# Altium schematic sheet Лист 3.SchDoc
size 420 x 297 mm; Scale: 1:1; Обозначение документа: АЛ.001.001 Э3; Номер листа: 3; Общее количество листов: 5; Разраб.: Иванов; Пров.: Петров; Утв.: Сидоров; Масштаб: 1:1; Наименование организации: ОАО "Ваша фирма"; Перв. применение: АБВГ.123456.000; Наименование изделия 3: Схема электрическая принципиальная; Нач. отд.: Нач. отд.; Фамилия нач. отд.: Сидоров
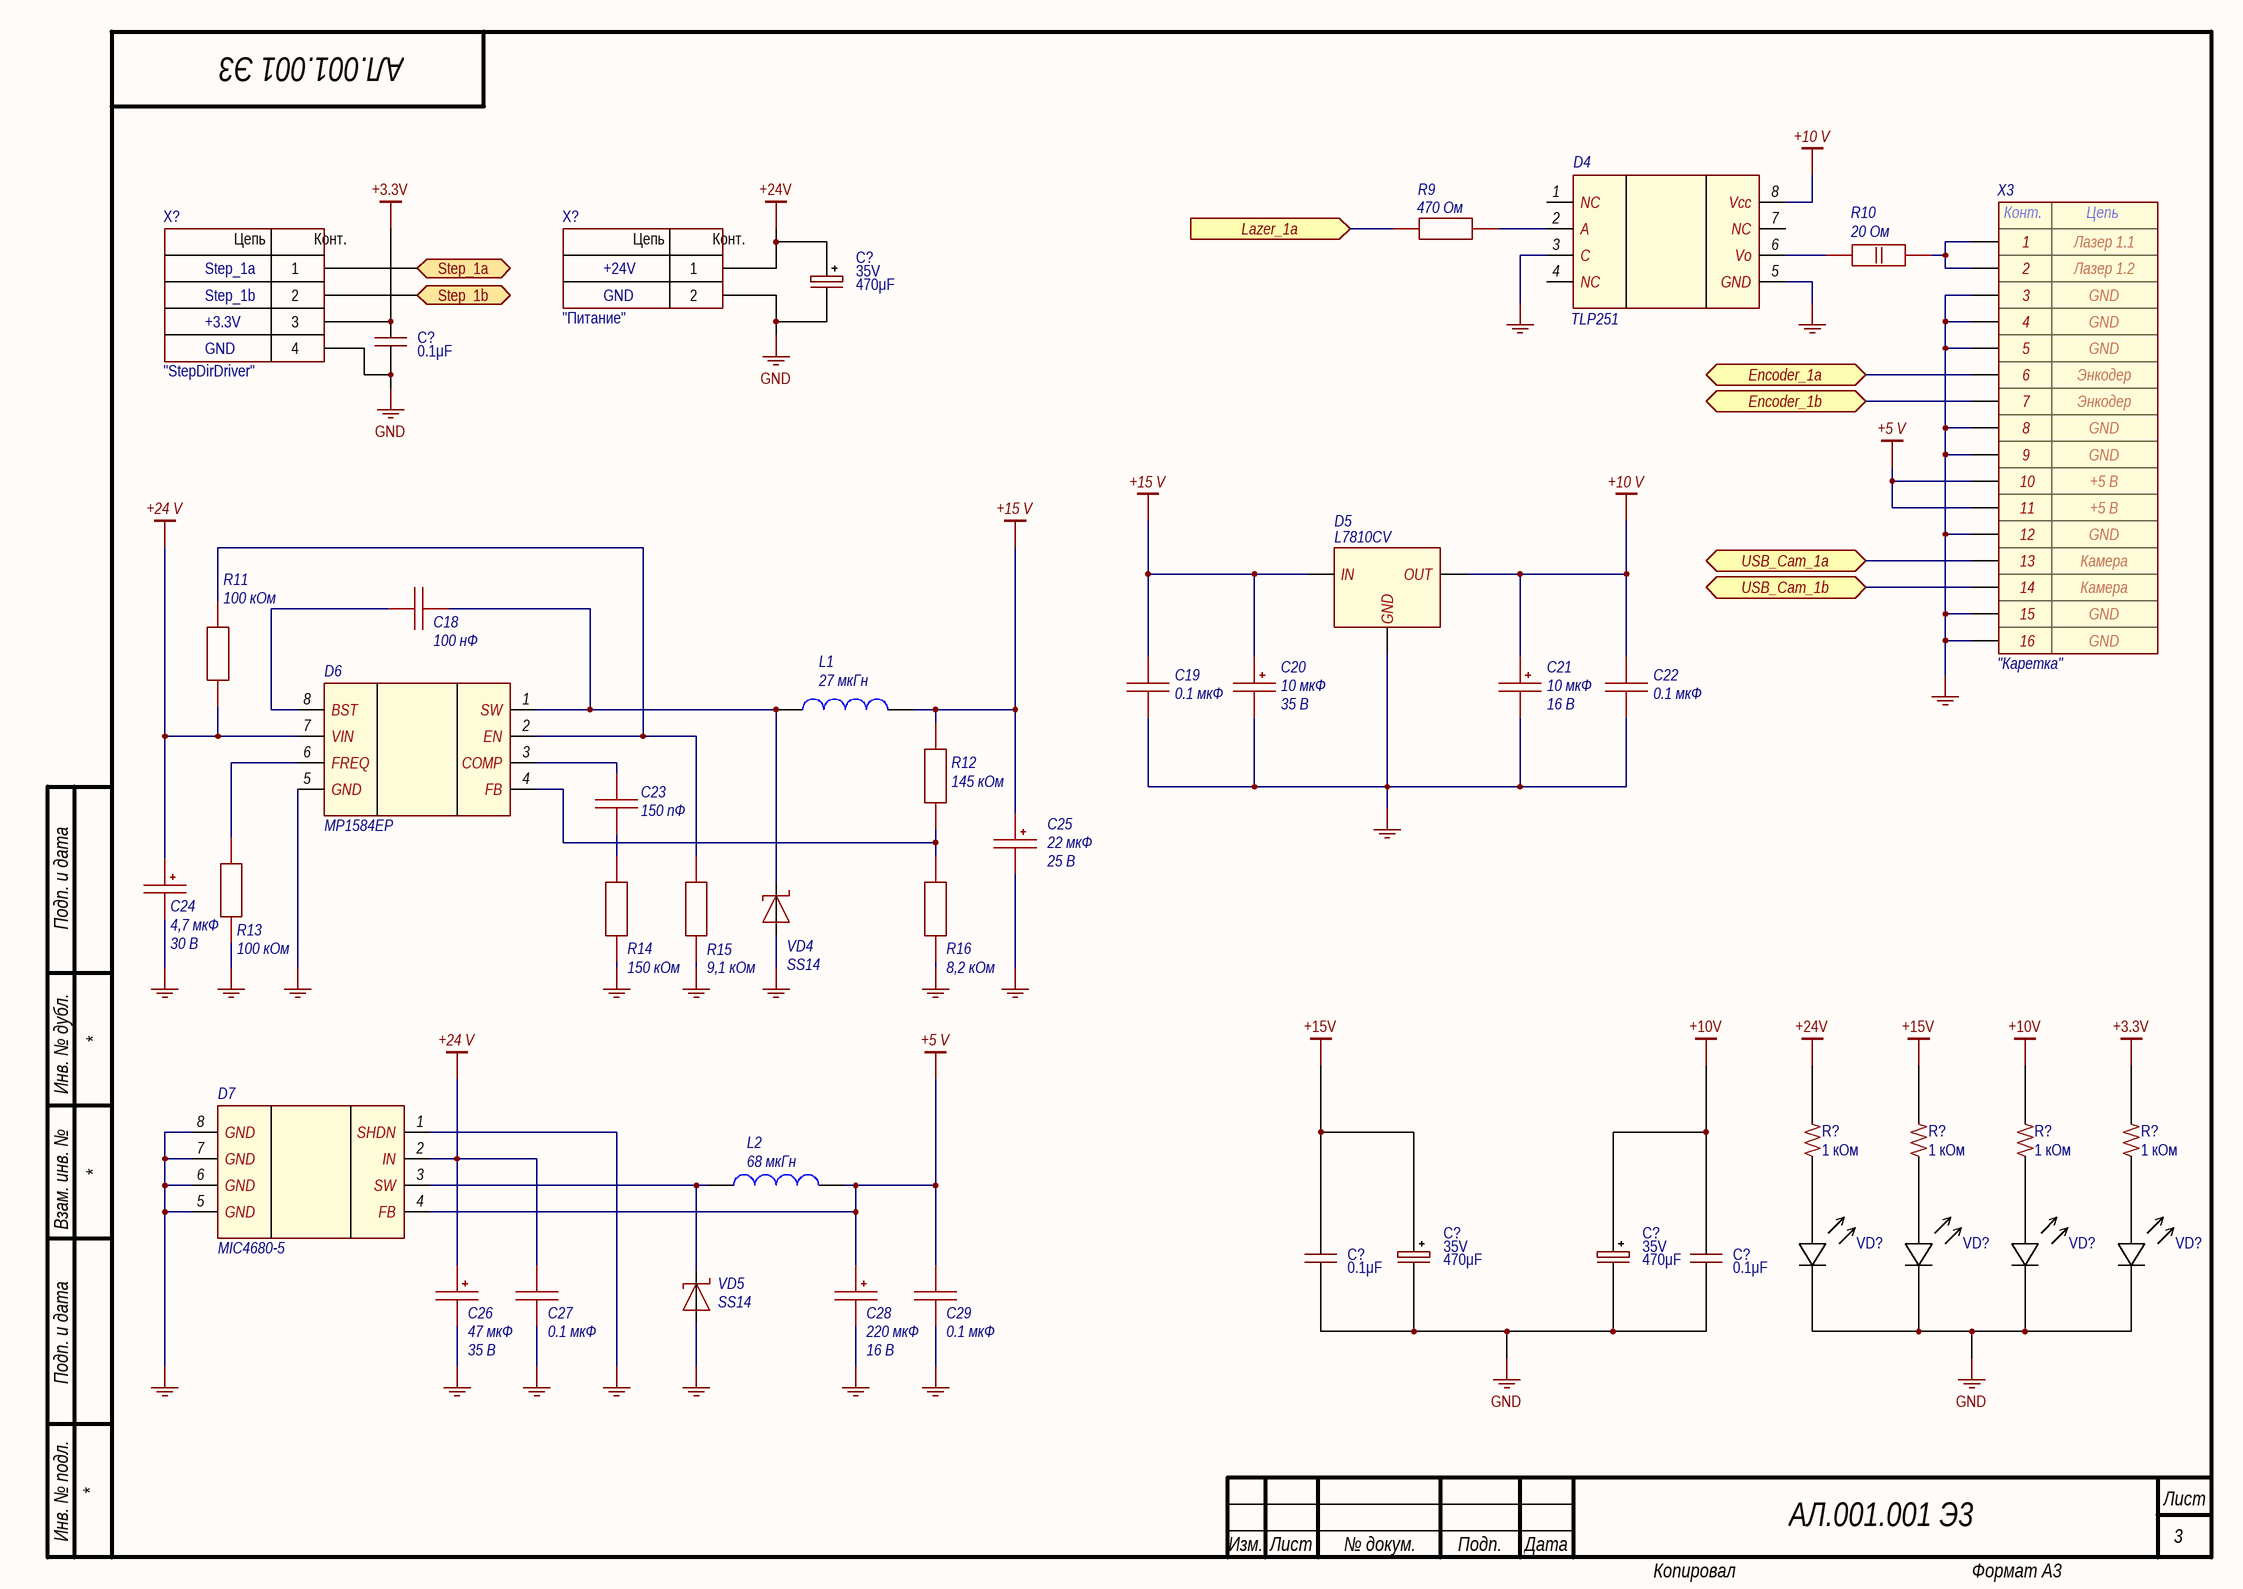
[diagram p0: Лист 3.SchDoc]

## Parts
(Parts that share a designator on the sheet are numbered #1, #2 ... from top to bottom, then left to right.)
C18  value 100 нФ  [CAP: 0805]
C19  value 0.1 мкФ  [CAP: 0805]
C20  value 10 мкФ  Voltage: 35 В  [CAP: D5C2H11]
C21  value 10 мкФ  Voltage: 16 В  [CAP: D5C2H11]
C22  value 0.1 мкФ  [CAP: 0805]
C23  value 150 пФ  [CAP: 0805]
C24  value 4,7 мкФ  Voltage: 30 В  [CAP: TANTAL-C]
C25  value 22 мкФ  Voltage: 25 В  [CAP: TANTAL-C]
C26  value 47 мкФ  Voltage: 35 В  [CAP: D5C2H11]
C27  value 0.1 мкФ  [CAP: 0805]
C28  value 220 мкФ  Voltage: 16 В  [CAP: D6.3C2.5H11]
C29  value 0.1 мкФ  [CAP: 0805]
C?#1  Напряжение: 35V  Значение: 470μF  [CAP: D10C5H12.5]
C?#2  Значение: 0.1μF  [CAP: 0805]  (hidden comment: Ceramic_SMD)
C?#3  Напряжение: 35V  Значение: 470μF  [CAP: D10C5H12.5]
C?#4  Напряжение: 35V  Значение: 470μF  [CAP: D10C5H12.5]
C?#5  Значение: 0.1μF  [CAP: 0805]  (hidden comment: Ceramic_SMD)
C?#6  Значение: 0.1μF  [CAP: 0805]  (hidden comment: Ceramic_SMD)
D4  TLP251  [8-SDIP]
D5  L7810CV  [TO220]
D6  MP1584EP  [8-SOIC]
D7  MIC4680-5  [8-SOIC]
L1  value 27 мкГн  [IND: 7.3x7.3]  (hidden comment: Inductor)
L2  value 68 мкГн  [IND: 7.3x7.3]  (hidden comment: Inductor)
R9  470 Ом  [RES: 0805]
R10  20 Ом  [RES: 2 W]
R11  value 100 кОм  [RES: 0805]  (hidden comment: 470 Ом)
R12  value 145 кОм  [RES: 0805]  (hidden comment: 470 Ом)
R13  value 100 кОм  [RES: 0805]  (hidden comment: 470 Ом)
R14  value 150 кОм  [RES: 0805]  (hidden comment: 470 Ом)
R15  value 9,1 кОм  [RES: 0805]  (hidden comment: 470 Ом)
R16  value 8,2 кОм  [RES: 0805]  (hidden comment: 470 Ом)
R?#1  Значение: 1 кОм  [RES: 0805]  (hidden comment: Resistor_SMD)
R?#2  Значение: 1 кОм  [RES: 0805]  (hidden comment: Resistor_SMD)
R?#3  Значение: 1 кОм  [RES: 0805]  (hidden comment: Resistor_SMD)
R?#4  Значение: 1 кОм  [RES: 0805]  (hidden comment: Resistor_SMD)
VD4  PartNumber: SS14  [DIODE: SMA]
VD5  PartNumber: SS14  [DIODE: SMA]
VD?#1  (no value)  [LED: 0805G]
VD?#2  (no value)  [LED: 0805G]
VD?#3  (no value)  [LED: 0805G]
VD?#4  (no value)  [LED: 0805G]
X3  CommentText: "Каретка"  [CON: IDC-16MS]
X?#1  CommentText: "StepDirDriver"  [CON: 15EDGVC-3.5-04]
X?#2  CommentText: "Питание"  [CON: 15EDGVC-3.5-02 (or 691321100002)]

## Ports
Encoder_1a (bidir), Encoder_1b (bidir), Lazer_1a (in), Step_1a (bidir), Step_1b (bidir), USB_Cam_1a (bidir), USB_Cam_1b (bidir)

## Nets
+3.3V: C?#2.2 R?#4.2 X?#1.3
+5 V: C28.1 C29.2 D7.4(FB) L2.2 X3.10 X3.11
+10 V: C21.1 C22.2 D4.8(Vcc) D5.3(OUT)
+10V: C?#4.1 C?#6.2 R?#3.2
+15 V: C19.2 C20.1 C25.1 D5.1(IN) L1.2 R12.1
+15V: C?#3.1 C?#5.2 R?#2.2
+24 V: C24.1 C26.1 C27.2 D6.7(VIN) D7.2(IN) R11.2
+24V: C?#1.1 R?#1.2 X?#2.1
GND: C19.1 C20.2 C21.2 C22.1 C24.2 C25.2 C26.2 C27.1 C28.2 C29.1 C?#1.2 C?#2.1 C?#3.2 C?#4.2 C?#5.1 C?#6.1 D4.3(C) D4.5(GND) D5.2(GND) D6.5(GND) D7.1(SHDN) D7.5(GND) D7.6(GND) D7.7(GND) D7.8(GND) R13.2 R14.2 R15.2 R16.2 VD4.1 VD5.1 VD?#1.2(C) VD?#2.2(C) VD?#3.2(C) VD?#4.2(C) X3.3 X3.4 X3.5 X3.8 X3.9 X3.12 X3.15 X3.16 X?#1.4 X?#2.2
Encoder_1a: X3.6 ; port Encoder_1a
Encoder_1b: X3.7 ; port Encoder_1b
Lazer_1a: R9.2 ; port Lazer_1a
Step_1a: X?#1.1 ; port Step_1a
Step_1b: X?#1.2 ; port Step_1b
USB_Cam_1a: X3.13 ; port USB_Cam_1a
USB_Cam_1b: X3.14 ; port USB_Cam_1b
NetC18_1: C18.1 D6.8(BST)
NetC18_2: C18.2 D6.1(SW) L1.1 VD4.2
NetC23_1: C23.1 R14.1
NetC23_2: C23.2 D6.3(COMP)
NetD4_2: D4.2(A) R9.1
NetD4_6: D4.6(Vo) R10.1
NetD6_2: D6.2(EN) R11.1 R15.1
NetD6_4: D6.4(FB) R12.2 R16.1
NetD6_6: D6.6(FREQ) R13.1
NetD7_3: D7.3(SW) L2.1 VD5.2
NetR10_2: R10.2 X3.1 X3.2
NetR?#1_1: R?#1.1 VD?#1.1(A)
NetR?#2_1: R?#2.1 VD?#2.1(A)
NetR?#3_1: R?#3.1 VD?#3.1(A)
NetR?#4_1: R?#4.1 VD?#4.1(A)

Not connected (* = marked no-connect by the designer): D4 1(NC) 4(NC) 7(NC)

## Notes on the sheet
- Step_1a
- Step_1b
- +3.3V
- +24V
- GND
- Подп. и дата
- Инв. № дубл.
- Взам. инв. №
- Инв. № подл.
- Изм.
- Лист
- № докум.
- Подп.
- Дата
- Копировал
- Формат А3
- (in symbol Connector_terminal_2pin) Цепь; Конт.
- (in symbol Connector_terminal_4pin) Цепь; Конт.
- (in symbol IDC-16) Конт.; Цепь

## Library data of the parts
C18 = Ceramic_0805: Manufacturer: Yageo; PartNumber: CC0805KRX7R7BB104; ValueManufacturerPartNumber: Ceramic capacitor, 100 нФ, X7R, ±10%, 16V, 0805, -55...+125°C; TypeCapacitor: Ceramic capacitor; Tolerance: ±10%; TypeDielectric: X7R; Voltage: 16V; Package: 0805; HelpURL: https://www.digikey.com/product-detail/en/yageo/CC0805KRX7R7BB104/311-1142-1-ND/303052; Temperature: -55...+125°C
C19 C22 C27 C29 = Ceramic_0805: Manufacturer: Yageo; PartNumber: CC0805KRX7R7BB104; ValueManufacturerPartNumber: Ceramic capacitor, 0.1 мкФ, X7R, ±10%, 16V, 0805, -55...+125°C; TypeCapacitor: Ceramic capacitor; Tolerance: ±10%; TypeDielectric: X7R; Voltage: 16V; Package: 0805; HelpURL: https://www.digikey.com/product-detail/en/yageo/CC0805KRX7R7BB104/311-1142-1-ND/303052; Temperature: -55...+125°C
C20 = Aluminium: Manufacturer: Wurth; PartNumber: 860080475013; ValueManufacturerPartNumber: Aluminium capacitor, 10 мкФ, 35 В, ±20%, 54mOhm, 14x10x5 mm, -55...+105°C; TypeCapacitor: Aluminium capacitor; Tolerance: ±20%; Impedance: 54mOhm; Package: 14x10x5 mm; HelpURL: https://www.digikey.com/product-detail/en/wurth-electronics-inc/860080475013/732-9029-1-ND/5728972; Temperature: -55...+105°C
C21 = Aluminium: Manufacturer: Wurth; PartNumber: 860080475013; ValueManufacturerPartNumber: Aluminium capacitor, 10 мкФ, 16 В, ±20%, 54mOhm, 14x10x5 mm, -55...+105°C; TypeCapacitor: Aluminium capacitor; Tolerance: ±20%; Impedance: 54mOhm; Package: 14x10x5 mm; HelpURL: https://www.digikey.com/product-detail/en/wurth-electronics-inc/860080475013/732-9029-1-ND/5728972; Temperature: -55...+105°C
C23 = Ceramic_0805: Manufacturer: Yageo; PartNumber: CC0805KRX7R7BB104; ValueManufacturerPartNumber: Ceramic capacitor, 150 пФ, X7R, ±10%, 16V, 0805, -55...+125°C; TypeCapacitor: Ceramic capacitor; Tolerance: ±10%; TypeDielectric: X7R; Voltage: 16V; Package: 0805; HelpURL: https://www.digikey.com/product-detail/en/yageo/CC0805KRX7R7BB104/311-1142-1-ND/303052; Temperature: -55...+125°C
C24 = Tantal_C: Manufacturer: AVX; PartNumber: F931E226MCC; ValueManufacturerPartNumber: Tantalum capacitor, 4,7 мкФ, 30 В, ±10%, 1.1Ohm, case C (6032), -55...+125°C; Impedance: 1.1Ohm; Tolerance: ±10%; TypeDielectric: X7R; TypeCapacitor: Tantalum capacitor; Package: case C (6032); HelpURL: https://www.digikey.com/product-detail/en/avx-corporation/F931E226MCC/478-8314-1-ND/4006045; Temperature: -55...+125°C
C25 = Tantal_C: Manufacturer: AVX; PartNumber: F931E226MCC; ValueManufacturerPartNumber: Tantalum capacitor, 22 мкФ, 25 В, ±10%, 1.1Ohm, case C (6032), -55...+125°C; Impedance: 1.1Ohm; Tolerance: ±10%; TypeDielectric: X7R; TypeCapacitor: Tantalum capacitor; Package: case C (6032); HelpURL: https://www.digikey.com/product-detail/en/avx-corporation/F931E226MCC/478-8314-1-ND/4006045; Temperature: -55...+125°C
C26 = Aluminium: Manufacturer: Wurth; PartNumber: 860080475013; ValueManufacturerPartNumber: Aluminium capacitor, 47 мкФ, 35 В, ±20%, 54mOhm, 14x10x5 mm, -55...+105°C; TypeCapacitor: Aluminium capacitor; Tolerance: ±20%; Impedance: 54mOhm; Package: 14x10x5 mm; HelpURL: https://www.digikey.com/product-detail/en/wurth-electronics-inc/860080475013/732-9029-1-ND/5728972; Temperature: -55...+105°C
C28 = Aluminium: Manufacturer: Wurth; PartNumber: 860080475013; ValueManufacturerPartNumber: Aluminium capacitor, 220 мкФ, 16 В, ±20%, 54mOhm, 14x10x5 mm, -55...+105°C; TypeCapacitor: Aluminium capacitor; Tolerance: ±20%; Impedance: 54mOhm; Package: 14x10x5 mm; HelpURL: https://www.digikey.com/product-detail/en/wurth-electronics-inc/860080475013/732-9029-1-ND/5728972; Temperature: -55...+105°C
C?#1 C?#3 C?#4 = Алюминиевые: Производитель: Wurth; УникальныйНомер: 860080475013; Типоразмер: 14x10x5 mm; Ссылка: ***; ТипКомпонента: Aluminium capacitor; Точность: ±20%
C?#2 C?#5 C?#6 = Ceramic_SMD: Производитель: Yageo; УникальныйНомер: CC0201KRX7R7BB103; Типоразмер: 0201; Ссылка: ***; ТипКомпонента: Ceramic capacitor; Точность: ±10%; ТипДиэлектрика: X7R; Напряжение: 16V
D5 = 78XX
D7 = MIC4680
L1 L2 = Inductor: Tolerance: ±10%
R9 = Resistor_0805: Manufacturer: Yageo; PartNumber: RC0805JR-07100RL; ValueManufacturerPartNumber: Resistor film, 470 Ом, ±5%, 0805, 0.125W, -55...+125°C; TypeResistor: Resistor film; Power: 0.125W; Tolerance: ±5%; Package: 0805; HelpURL: https://www.digikey.com/product-detail/en/yageo/RC0805JR-07100RL/311-100ARCT-ND/731185; Temperature: -55...+125°C; Value: 470 Ом
R10 = Резистор 2 Вт TH: Value: 20 Ом
R11 R13 = Resistor_0805: Manufacturer: Yageo; PartNumber: RC0805JR-07100RL; ValueManufacturerPartNumber: Resistor film, 100 кОм, ±5%, 0805, 0.125W, -55...+125°C; TypeResistor: Resistor film; Power: 0.125W; Tolerance: ±5%; Package: 0805; HelpURL: https://www.digikey.com/product-detail/en/yageo/RC0805JR-07100RL/311-100ARCT-ND/731185; Temperature: -55...+125°C
R12 = Resistor_0805: Manufacturer: Yageo; PartNumber: RC0805JR-07100RL; ValueManufacturerPartNumber: Resistor film, 145 кОм, ±5%, 0805, 0.125W, -55...+125°C; TypeResistor: Resistor film; Power: 0.125W; Tolerance: ±5%; Package: 0805; HelpURL: https://www.digikey.com/product-detail/en/yageo/RC0805JR-07100RL/311-100ARCT-ND/731185; Temperature: -55...+125°C
R14 = Resistor_0805: Manufacturer: Yageo; PartNumber: RC0805JR-07100RL; ValueManufacturerPartNumber: Resistor film, 150 кОм, ±5%, 0805, 0.125W, -55...+125°C; TypeResistor: Resistor film; Power: 0.125W; Tolerance: ±5%; Package: 0805; HelpURL: https://www.digikey.com/product-detail/en/yageo/RC0805JR-07100RL/311-100ARCT-ND/731185; Temperature: -55...+125°C
R15 = Resistor_0805: Manufacturer: Yageo; PartNumber: RC0805JR-07100RL; ValueManufacturerPartNumber: Resistor film, 9,1 кОм, ±5%, 0805, 0.125W, -55...+125°C; TypeResistor: Resistor film; Power: 0.125W; Tolerance: ±5%; Package: 0805; HelpURL: https://www.digikey.com/product-detail/en/yageo/RC0805JR-07100RL/311-100ARCT-ND/731185; Temperature: -55...+125°C
R16 = Resistor_0805: Manufacturer: Yageo; PartNumber: RC0805JR-07100RL; ValueManufacturerPartNumber: Resistor film, 8,2 кОм, ±5%, 0805, 0.125W, -55...+125°C; TypeResistor: Resistor film; Power: 0.125W; Tolerance: ±5%; Package: 0805; HelpURL: https://www.digikey.com/product-detail/en/yageo/RC0805JR-07100RL/311-100ARCT-ND/731185; Temperature: -55...+125°C
R?#1-R?#4 = Resistor_SMD: Производитель: YAGEO; УникальныйНомер: RC0201JR-07100RL; Типоразмер: 0201; Ссылка: ***; ТипКомпонента: Резистор SMD; Точность: ±5%
VD4 VD5 = Schottky_single: Manufacturer: Diodes Incorporated; ValueManufacturerPartNumber: Schottky diode, 80V, 500mA, 1V, 15pF, SOD-123, -55...+150°C; TypeDiode: Schottky diode; Voltage: 80V; Current: 500mA; VoltageDrop: 1V; RecoveryTime: 15pF; Package: SOD-123; HelpURL: https://www.digikey.com/product-detail/en/diodes-incorporated/MBR0580S1-7/MBR0580S1-7DICT-ND/5080371; Temperature: -55...+150°C
VD?#1-VD?#4 = LED_single: ValueManufacturerPartNumber: LED, Green, *, *, *, -55...+150°C; TypeDiode: LED; ColorParameter: Green; Manufacturer: *; Package: *; HelpURL: *; Temperature: -55...+150°C; Current: *; VoltageDrop: *; PartNumber: *; Color: GREEN
X3 = IDC-16: Manufacturer: Connfly; ValueManufacturerPartNumber: Connector, 16pin, 2.54mm, 250VAC, 3A; TypeConnector: Connector; VoltageMax: 250VAC; Pitch: 2.54mm; CurrentMax: 3A; Multichannel: 16pin; Pin_1: Лазер 1.1; Pin_2: Лазер 1.2; Pin_3: GND; Pin_6: Энкодер; Pin_10: +5 В; Pin_13: Камера; HelpURL: https://www.chipdip.ru/product/idc-16ms; PartNumber: IDC-16; Pin_4: GND; Pin_5: GND; Pin_7: Энкодер; Pin_8: GND; Pin_9: GND; Pin_11: +5 В; Pin_12: GND; Pin_14: Камера; Pin_15: GND; Pin_16: GND
X?#1 = Connector_terminal_4pin: Manufacturer: Degson; ValueManufacturerPartNumber: Terminal connector, 6pin, 3.5mm, 300VAC, 10A; PartNumber: DG350-3.5-06P-14; TypeConnector: Terminal connector; VoltageMax: 300VAC; Pitch: 3.5mm; CurrentMax: 10A; Multichannel: 6pin; HelpURL: https://www.compel.ru/infosheet/DEGSON/DG350-3.5-06P-14-00AH
X?#2 = Connector_terminal_2pin: Manufacturer: Degson; ValueManufacturerPartNumber: Terminal connector, 2pin, 3.5mm, 300VAC, 10A; PartNumber: DG350-3.5-02P-14; TypeConnector: Terminal connector; VoltageMax: 300VAC; Pitch: 3.5mm; CurrentMax: 10A; Multichannel: 2pin; HelpURL: https://www.chipdip.ru/product/dg350-3.5-02p-12